# Altium schematic sheet Evaluation kit.SchDoc
size A3; SheetNumber: 1; SheetTotal: 1
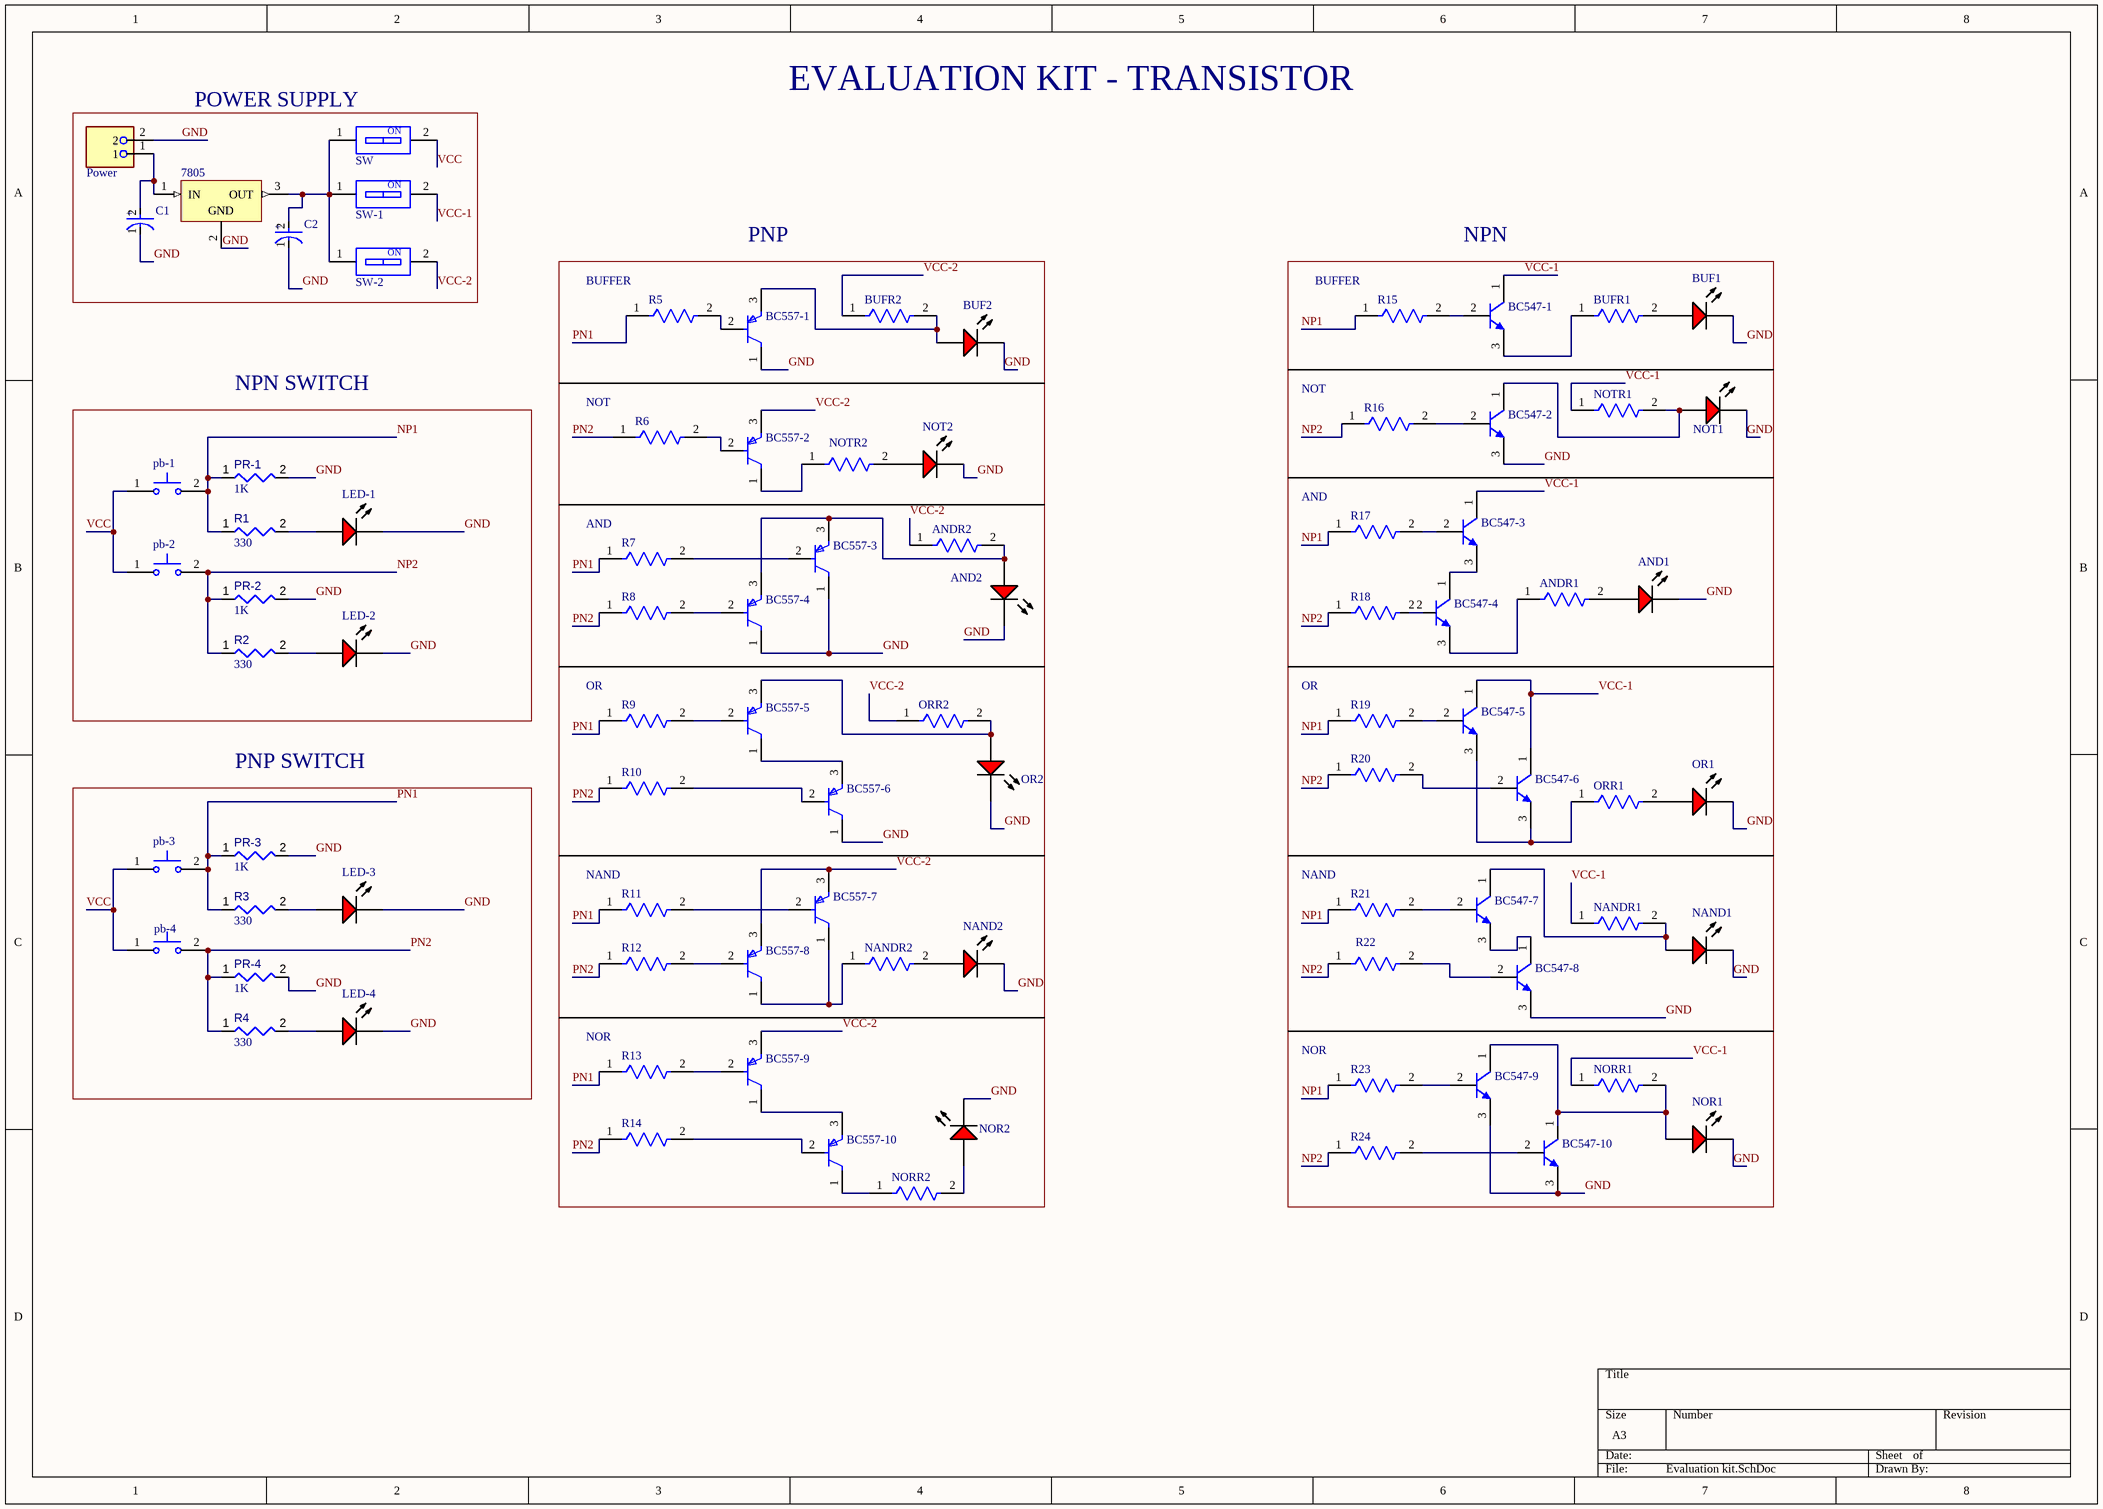
[diagram p0: Evaluation kit.SchDoc]

## Parts
7805  LM7805ACT  [FAIR-TO-220-3]  (value not drawn)
AND1  LTL-1CHE  [INDPR60-254-520X380X650]  (value not drawn)
AND2  LTL-1CHE  [INDPR60-254-520X380X650]  (value not drawn)
ANDR1  MBA02040C2200FC100  [FP-MBA0204-MFG]  (value not drawn)
ANDR2  MBA02040C2200FC100  [FP-MBA0204-MFG]  (value not drawn)
BC547-1  BC547BRL1G  [ONSC-TO-92-3-29-11_AM_BL]  (value not drawn)
BC547-2  BC547BRL1G  [ONSC-TO-92-3-29-11_AM_BL]  (value not drawn)
BC547-3  BC547BRL1G  [ONSC-TO-92-3-29-11_AM_BL]  (value not drawn)
BC547-4  BC547BRL1G  [ONSC-TO-92-3-29-11_AM_BL]  (value not drawn)
BC547-5  BC547BRL1G  [ONSC-TO-92-3-29-11_AM_BL]  (value not drawn)
BC547-6  BC547BRL1G  [ONSC-TO-92-3-29-11_AM_BL]  (value not drawn)
BC547-7  BC547BRL1G  [ONSC-TO-92-3-29-11_AM_BL]  (value not drawn)
BC547-8  BC547BRL1G  [ONSC-TO-92-3-29-11_AM_BL]  (value not drawn)
BC547-9  BC547BRL1G  [ONSC-TO-92-3-29-11_AM_BL]  (value not drawn)
BC547-10  BC547BRL1G  [ONSC-TO-92-3-29-11_AM_BL]  (value not drawn)
BC557-1  BC557BTF  [FP-135AR-MFG]  (value not drawn)
BC557-2  BC557BTF  [FP-135AR-MFG]  (value not drawn)
BC557-3  BC557BTF  [FP-135AR-MFG]  (value not drawn)
BC557-4  BC557BTF  [FP-135AR-MFG]  (value not drawn)
BC557-5  BC557BTF  [FP-135AR-MFG]  (value not drawn)
BC557-6  BC557BTF  [FP-135AR-MFG]  (value not drawn)
BC557-7  BC557BTF  [FP-135AR-MFG]  (value not drawn)
BC557-8  BC557BTF  [FP-135AR-MFG]  (value not drawn)
BC557-9  BC557BTF  [FP-135AR-MFG]  (value not drawn)
BC557-10  BC557BTF  [FP-135AR-MFG]  (value not drawn)
BUF1  LTL-1CHE  [INDPR60-254-520X380X650]  (value not drawn)
BUF2  LTL-1CHE  [INDPR60-254-520X380X650]  (value not drawn)
BUFR1  MBA02040C2200FC100  [FP-MBA0204-MFG]  (value not drawn)
BUFR2  MBA02040C2200FC100  [FP-MBA0204-MFG]  (value not drawn)
C1  EEU-FR1H101B  [FP-EEU-FR1H101B-MFG]  (value not drawn)
C2  EEU-FR1H101B  [FP-EEU-FR1H101B-MFG]  (value not drawn)
LED-1  LTL-1CHE  [INDPR60-254-520X380X650]  (value not drawn)
LED-2  LTL-1CHE  [INDPR60-254-520X380X650]  (value not drawn)
LED-3  LTL-1CHE  [INDPR60-254-520X380X650]  (value not drawn)
LED-4  LTL-1CHE  [INDPR60-254-520X380X650]  (value not drawn)
NAND1  LTL-1CHE  [INDPR60-254-520X380X650]  (value not drawn)
NAND2  LTL-1CHE  [INDPR60-254-520X380X650]  (value not drawn)
NANDR1  MBA02040C2200FC100  [FP-MBA0204-MFG]  (value not drawn)
NANDR2  MBA02040C2200FC100  [FP-MBA0204-MFG]  (value not drawn)
NOR1  LTL-1CHE  [INDPR60-254-520X380X650]  (value not drawn)
NOR2  LTL-1CHE  [INDPR60-254-520X380X650]  (value not drawn)
NORR1  MBA02040C2200FC100  [FP-MBA0204-MFG]  (value not drawn)
NORR2  MBA02040C2200FC100  [FP-MBA0204-MFG]  (value not drawn)
NOT1  LTL-1CHE  [INDPR60-254-520X380X650]  (value not drawn)
NOT2  LTL-1CHE  [INDPR60-254-520X380X650]  (value not drawn)
NOTR1  MBA02040C2200FC100  [FP-MBA0204-MFG]  (value not drawn)
NOTR2  MBA02040C2200FC100  [FP-MBA0204-MFG]  (value not drawn)
OR1  LTL-1CHE  [INDPR60-254-520X380X650]  (value not drawn)
OR2  LTL-1CHE  [INDPR60-254-520X380X650]  (value not drawn)
ORR1  MBA02040C2200FC100  [FP-MBA0204-MFG]  (value not drawn)
ORR2  MBA02040C2200FC100  [FP-MBA0204-MFG]  (value not drawn)
pb-1  BUTT-2  [SW_BUTT-2]  (value not drawn)
pb-2  BUTT-2  [SW_BUTT-2]  (value not drawn)
pb-3  BUTT-2  [SW_BUTT-2]  (value not drawn)
pb-4  BUTT-2  [SW_BUTT-2]  (value not drawn)
Power  1729128  [PHOENIX_1729128]  (value not drawn)
PR-1  value 1K  [RESA60-630X240]  (hidden comment: MFR-25FBF52-100R)
PR-2  value 1K  [RESA60-630X240]  (hidden comment: MFR-25FBF52-100R)
PR-3  value 1K  [RESA60-630X240]  (hidden comment: MFR-25FBF52-100R)
PR-4  value 1K  [RESA60-630X240]  (hidden comment: MFR-25FBF52-100R)
R1  value 330  [RESA60-630X240]  (hidden comment: MFR-25FBF52-100R)
R2  value 330  [RESA60-630X240]  (hidden comment: MFR-25FBF52-100R)
R3  value 330  [RESA60-630X240]  (hidden comment: MFR-25FBF52-100R)
R4  value 330  [RESA60-630X240]  (hidden comment: MFR-25FBF52-100R)
R5  MBA02040C2200FC100  [FP-MBA0204-MFG]  (value not drawn)
R6  MBA02040C2200FC100  [FP-MBA0204-MFG]  (value not drawn)
R7  MBA02040C2200FC100  [FP-MBA0204-MFG]  (value not drawn)
R8  MBA02040C2200FC100  [FP-MBA0204-MFG]  (value not drawn)
R9  MBA02040C2200FC100  [FP-MBA0204-MFG]  (value not drawn)
R10  MBA02040C2200FC100  [FP-MBA0204-MFG]  (value not drawn)
R11  MBA02040C2200FC100  [FP-MBA0204-MFG]  (value not drawn)
R12  MBA02040C2200FC100  [FP-MBA0204-MFG]  (value not drawn)
R13  MBA02040C2200FC100  [FP-MBA0204-MFG]  (value not drawn)
R14  MBA02040C2200FC100  [FP-MBA0204-MFG]  (value not drawn)
R15  MBA02040C2200FC100  [FP-MBA0204-MFG]  (value not drawn)
R16  MBA02040C2200FC100  [FP-MBA0204-MFG]  (value not drawn)
R17  MBA02040C2200FC100  [FP-MBA0204-MFG]  (value not drawn)
R18  MBA02040C2200FC100  [FP-MBA0204-MFG]  (value not drawn)
R19  MBA02040C2200FC100  [FP-MBA0204-MFG]  (value not drawn)
R20  MBA02040C2200FC100  [FP-MBA0204-MFG]  (value not drawn)
R21  MBA02040C2200FC100  [FP-MBA0204-MFG]  (value not drawn)
R22  MBA02040C2200FC100  [FP-MBA0204-MFG]  (value not drawn)
R23  MBA02040C2200FC100  [FP-MBA0204-MFG]  (value not drawn)
R24  MBA02040C2200FC100  [FP-MBA0204-MFG]  (value not drawn)
SW  418117170901  [418117170901]  (value not drawn)
SW-1  418117170901  [418117170901]  (value not drawn)
SW-2  418117170901  [418117170901]  (value not drawn)

## Blocks framed on the sheet
POWER SUPPLY: 7805 C1 C2 Power SW SW-1 SW-2
PNP: AND2 ANDR2 BC557-1-BC557-10 BUF2 BUFR2 NAND2 NANDR2 NOR2 NORR2 NOT2 NOTR2 OR2 ORR2 R5-R14
NPN: AND1 ANDR1 BC547-1-BC547-10 BUF1 BUFR1 NAND1 NANDR1 NOR1 NORR1 NOT1 NOTR1 OR1 ORR1 R15-R24
NPN SWITCH: LED-1 LED-2 pb-1 pb-2 PR-1 PR-2 R1 R2
PNP SWITCH: LED-3 LED-4 pb-3 pb-4 PR-3 PR-4 R3 R4

## Nets
GND: 7805.2(GND) AND1.2(K) AND2.2(K) BC547-2.3(E) BC547-8.3(E) BC547-9.3(E) BC547-10.3(E) BC557-1.1(C) BC557-3.1(C) BC557-4.1(C) BC557-6.1(C) BUF1.2(K) BUF2.2(K) C1.1(C) C2.1(C) LED-1.2(K) LED-2.2(K) LED-3.2(K) LED-4.2(K) NAND1.2(K) NAND2.2(K) NOR1.2(K) NOR2.2(K) NOT1.2(K) NOT2.2(K) OR1.2(K) OR2.2(K) Power.2 PR-1.2 PR-2.2 PR-3.2 PR-4.2
NP1: pb-1.2 PR-1.1 R1.1 R15.1 R17.1 R19.1 R21.1 R23.1
NP2: pb-2.2 PR-2.1 R2.1 R16.1 R18.1 R20.1 R22.1 R24.1
PN1: pb-3.2 PR-3.1 R3.1 R5.1 R7.1 R9.1 R11.1 R13.1
PN2: pb-4.2 PR-4.1 R4.1 R6.1 R8.1 R10.1 R12.1 R14.1
VCC: pb-1.1 pb-2.1 pb-3.1 pb-4.1 SW.2
VCC-1: BC547-1.1(C) BC547-3.1(C) BC547-5.1(C) BC547-6.1(C) NANDR1.1 NORR1.1 NOTR1.1 SW-1.2
VCC-2: ANDR2.1 BC557-2.3(E) BC557-7.3(E) BC557-8.3(E) BC557-9.3(E) BUFR2.1 ORR2.1 SW-2.2
Net7805_1: 7805.1(IN) C1.2(A) Power.1
Net7805_3: 7805.3(OUT) C2.2(A) SW.1 SW-1.1 SW-2.1
NetAND1_1: AND1.1(A) ANDR1.2
NetAND2_1: AND2.1(A) ANDR2.2 BC557-3.3(E) BC557-4.3(E)
NetANDR1_1: ANDR1.1 BC547-4.3(E)
NetBC547-1_2: BC547-1.2(B) R15.2
NetBC547-1_3: BC547-1.3(E) BUFR1.1
NetBC547-2_1: BC547-2.1(C) NOT1.1(A) NOTR1.2
NetBC547-2_2: BC547-2.2(B) R16.2
NetBC547-3_2: BC547-3.2(B) R17.2
NetBC547-3_3: BC547-3.3(E) BC547-4.1(C)
NetBC547-4_2: BC547-4.2(B) R18.2
NetBC547-5_2: BC547-5.2(B) R19.2
NetBC547-5_3: BC547-5.3(E) BC547-6.3(E) ORR1.1
NetBC547-6_2: BC547-6.2(B) R20.2
NetBC547-7_1: BC547-7.1(C) NAND1.1(A) NANDR1.2
NetBC547-7_2: BC547-7.2(B) R21.2
NetBC547-7_3: BC547-7.3(E) BC547-8.1(C)
NetBC547-8_2: BC547-8.2(B) R22.2
NetBC547-9_1: BC547-9.1(C) BC547-10.1(C) NOR1.1(A) NORR1.2
NetBC547-9_2: BC547-9.2(B) R23.2
NetBC547-10_2: BC547-10.2(B) R24.2
NetBC557-1_2: BC557-1.2(B) R5.2
NetBC557-1_3: BC557-1.3(E) BUF2.1(A) BUFR2.2
NetBC557-2_1: BC557-2.1(C) NOTR2.1
NetBC557-2_2: BC557-2.2(B) R6.2
NetBC557-3_2: BC557-3.2(B) R7.2
NetBC557-4_2: BC557-4.2(B) R8.2
NetBC557-5_1: BC557-5.1(C) BC557-6.3(E)
NetBC557-5_2: BC557-5.2(B) R9.2
NetBC557-5_3: BC557-5.3(E) OR2.1(A) ORR2.2
NetBC557-6_2: BC557-6.2(B) R10.2
NetBC557-7_1: BC557-7.1(C) BC557-8.1(C) NANDR2.1
NetBC557-7_2: BC557-7.2(B) R11.2
NetBC557-8_2: BC557-8.2(B) R12.2
NetBC557-9_1: BC557-9.1(C) BC557-10.3(E)
NetBC557-9_2: BC557-9.2(B) R13.2
NetBC557-10_1: BC557-10.1(C) NORR2.1
NetBC557-10_2: BC557-10.2(B) R14.2
NetBUF1_1: BUF1.1(A) BUFR1.2
NetLED-1_1: LED-1.1(A) R1.2
NetLED-2_1: LED-2.1(A) R2.2
NetLED-3_1: LED-3.1(A) R3.2
NetLED-4_1: LED-4.1(A) R4.2
NetNAND2_1: NAND2.1(A) NANDR2.2
NetNOR2_1: NOR2.1(A) NORR2.2
NetNOT2_1: NOT2.1(A) NOTR2.2
NetOR1_1: OR1.1(A) ORR1.2

## Notes on the sheet
- EVALUATION KIT - TRANSISTOR
- (near R5) BUFFER
- (near R15) BUFFER
- (near R6) NOT
- NOT
- (near R17) AND
- (near R7) AND
- (near R9) OR
- (near R19) OR
- (near R11) NAND
- (near R21) NAND
- (near R13) NOR
- (near R23) NOR
- (in symbol 418117170901) ON
- (in symbol CMP-05427-000020-1) +

## Library data of the parts
7805 = CMP-2000-04937-1: Positive Voltage Regulator, 5 V, 1 A, 0 to 125 degC, 3-Pin TO-220, RoHS, Tube; Manufacturer: Fairchild; Number of Outputs: 1; Typical Dropout Voltage @ Current: 2V@1A; Output Type: Fixed; Output Voltage: 5V; Quiescent Current: 6mA; Dropout Voltage Measurement Current: 1A; Line Regulation: 50mV; Maximum Input Voltage: 35V; Regulator Function: Linear; Load Regulation: 100mV; Package Type: TO-220; Mounting Type: ThroughHole; Height: 16.51mm; Maximum Operating Temperature: +125degC; Datasheet Version: Rev. 1.0.1, 05/2006; Package Reference: TO-220; Minimum Operating Temperature: 0degC; Manufacturer URL: https://www.fairchildsemi.com/; Package URL: https://www.fairchildsemi.com/package-drawings/TO/TO220B03.pdf; Length: 10.67mm; Series: LM78xx; Dimensions: 10.67x4.83x16.51mm; Polarity: Positive; Maximum Output Current: 1A; Pin Count: 3; Width: 4.83mm; Package Description: 3-Pin Through Hole Device, Body 10 x 4.5 mm, Pitch 2.54 mm; Datasheet URL: https://datasheet.ciiva.com/5816/1359194-5816420.pdf
AND1 AND2 BUF1 BUF2 LED-1-LED-4 NAND1 NAND2 NOR1 NOR2 NOT1 NOT2 OR1 OR2 = CMP-007-00018-2: LED Uni-Color Red, 100 mW, 30 mA, -55 to 100 degC, 2-Pin THD, RoHS, Bulk; Manufacturer: Lite-On; Forward Current: 20mA; Nominal Vf: 2V; Viewing Angle: 60degrees; Luminous Intensity: 12.6mcd; Lens Style: Dome; Pins: 2; RoHS Compliant: True; Package Reference: LTL-1CHE; Package Quantity: 1000; Mounting Technology: TH; Min Operating Temperature: -55°C; Colour: Red; Case/Package: Radial; Manufacturer URL: http://www.us.liteon.com/; Datasheet URL: https://datasheet.ciiva.com/15117/getdatasheetpartid-187746-15117985.pdf; Forward Voltage: 2V; Max Operating Temperature: 100°C; Illumination Colour: Red; Package Description: 2-Pin Through Hole Device, Dia 3.8 mm, Pitch 2.54 mm; Packaging: Bulk; Datasheet Version: Dec-03
ANDR1 ANDR2 BUFR1 BUFR2 NANDR1 NANDR2 NORR1 NORR2 NOTR1 NOTR2 ORR1 ORR2 R5-R24 = CMP-02408-000005-1: RES 220 OHM 0.4W 1% AXIAL; Manufacturer: Vishay BC Components; Automotive Grade: Grade 1; Value: 220Ω; Voltage Rating: 200V; Temperature Coefficient: 50ppm/°C; Power Rating: 0.25W; Digikey Description: RES 220 OHM 0.4W 1% AXIAL; Height: 1.6mm; Automotive: Yes; Lead Free: Yes; Mouser Description: Thin Film Resistors - Through Hole .4watt 220ohms 1% 1/8watt body size; Temperature Range Low: -55°C; ComponentLink2Description: Datasheet; Temperature: -55°C to +125°C; Device Class L3: Through-Hole Resistors; Manufacturer Part Number: MBA02040C2200FC100; Ipc Land Pattern Name: RESAD500W65L360D160; Octopart: https://octopart.com/mba02040c2200fc100-vishay-43743094; Series: MBA/SMA 0204; RoHS: TRUE; Tolerance: 1%; Package: MBA0204; Device Class L1: Passive Components; ComponentLink2URL: http://www.vishay.com/docs/28766/mbxsma.pdf; Category: Res; Composition: Metal Film; Device Class L2: Resistors; Temperature Range High: +125°C; Resistance: 220Ω
BC547-1-BC547-10 = CMP-1048-01605-1: Amplifier Transistor, NPN Silicon, 3-Pin TO-92, Pb-Free, Tape and Reel; Manufacturer: On Semiconductor; IC Continuous (A): 0.1; fT Min (MHz): 150; ComponentLink2URL: http://www.onsemi.com/pub_link/Collateral/BC546-D.PDF; ComponentLink1URL: http://www.onsemi.com/; ComponentLink2Description: Datasheet; RoHS: TRUE; ComponentLink3Description: Package Specification; ComponentLink1Description: Manufacturer URL; ComponentLink3URL: http://www.onsemi.com/pub_link/Collateral/MAC97-D.PDF; PackageDescription: 3-Pin Transistor Outline, Body 4.825 x 3.685 mm, Pitch 1.27 mm; Packing: Tape and Reel; PackageVersion: Rev. AM; Polarity: NPN; DatasheetVersion: Rev. 7; Mounting Technology: Through Hole; PackageReference: TO-92-3-29-11_AM_BL; PartNumber: BC547BRL1G
BC557-1-BC557-10 = CMP-00278-84408945-1: BC557BTF Small Signal Bipolar Transistor, 0.1A I(C), 45V V(BR)CEO, 1-Element, PNP, Silicon, TO-92; Manufacturer Lifecycle Status: ACTIVE; Max Power Dissipation: 500mW; Frequency: 150MHz; hFE Min: 110; Number of Elements: 1; Current Rating: -100mA; Collector Emitter Saturation Voltage: -250mV; Max Collector Current: 100mA; Emitter Base Voltage (VEBO): -5V; Voltage Rating (DC): -45V; Element Configuration: Single; Max Frequency: 10MHz; Collector Base Voltage (VCBO): -50V; Collector Emitter Voltage (VCEO): 45V; Contact Plating: Tin; Min Operating Temperature: -65°C; RoHS: Compliant; Max Operating Temperature: 150°C; Weight: 240mg; Power Dissipation: 500mW; Lifecycle Status: Production; Case/Package: TO-92; Collector Emitter Breakdown Voltage: 45V; Length: 5.2mm; Schedule B: 8541210080, 8541210080; Lead Free: Lead Free; Polarity: PNP; REACH SVHC: No SVHC; Mount: Through Hole; NexarPartId: 84408945; Max Breakdown Voltage: 45V; Transition Frequency: 150MHz; Height: 5.33mm; Number of Pins: 3; Gain Bandwidth Product: 150MHz; Width: 4.19mm
C1 C2 = CMP-05427-000020-1: CAP ALUM 100UF 20% 50V RADIAL; Life (Hours): 6000Hour; Ripple Current: 870mA; Lead Diameter: 0.6mm; Impedance: 61mR; Tolerance: 20%; Mount: Through Hole; Lead Free: Lead Free; Length: 11.5mm; Height - Seated (Max): 0.512inch; Contact Plating: Tin; Termination: Radial; Series: FR; Max Operating Temperature: 105°C; Features: General Purpose; Min Operating Temperature: -40°C; RoHS Compliant: Yes; Height: 11.5mm; Voltage Rating (DC): 50V; Diameter: 8mm; Capacitance: 100uF; Lead Pitch: 5mm; Radiation Hardening: No; Package Quantity: 1; Case/Package: Radial; Voltage Rating: 50V; Packaging: Tape and Reel; ESR (Equivalent Series Resistance): 61mR; REACH SVHC: No SVHC
pb-1-pb-4 = BUTT-2: Tactile Switches MINI PUSH BUTTON SWITCH 2-PIN QTY. 4; MF: Gravitech; Purchase-URL: https://pricing.snapeda.com/search/part/BUTT-2/?ref=eda; Package: None; Value: *; Check_prices: https://www.snapeda.com/parts/BUTT-2/Gravitech/view-part/?ref=eda; SnapEDA_Link: https://www.snapeda.com/parts/BUTT-2/Gravitech/view-part/?ref=snap; Availability: In Stock; Price: None; MP: BUTT-2
Power = 1729128: PCB Terminal Screw 5.08mm 16AWG 400V 13.5A 2 Position COMBICON MKDSN Series | Phoenix Contact 1729128; SnapEDA_Link: https://www.snapeda.com/parts/1729128/Phoenix+Contact/view-part/?ref=snap; Package: None; Value: *; MF: Phoenix Contact; MP: 1729128; Check_prices: https://www.snapeda.com/parts/1729128/Phoenix+Contact/view-part/?ref=eda
PR-1-PR-4 R1-R4 = CMP-009-00046-4: Axial Resistor, 100 Ohm, +/- 1%, 0.25 W, -55 to 155 degC, 2-Pin THD, RoHS, Bulk; Manufacturer: Yageo; Voltage Rating: 250V; Power: 250mW; Packaging: Bulk; Max Operating Temperature: 155°C; Mounting Technology: TH; Datasheet Version: Apr-13; Case/Package: Axial; RoHS Compliant: True; Package Description: 2-Pin Axial Lead, Dia 2.4 mm, Body Length 6.3 mm; Package Quantity: 200; Package Reference: MFR-25; Tolerance: 1%; Composition: CarbonFilm; Datasheet URL: http://www.yageo.com/documents/recent/Yageo%20LR_MFR_2013.pdf; Manufacturer URL: http://www.yageo.com/; Min Operating Temperature: -55°C
SW SW-1 SW-2 = 418117170901: WS-DITV Compact THT Dip Switch, Flat Actuator, pitch 2.54mm, 1p; Manufacturer: Wurth Elektronik; Actuator Type: Flat Type; Operation Force: 800g; Rated Current Non-Switching: 100mA; Rated Current Switching: 25mA; Rated Voltage Non-Switching: 50VDC; Rated Voltage Switching: 24VDC; Number of Poles: 1; ComponentLink1Description: Website Link; ComponentLink1URL: https://www.we-online.com/redexpert/article/418117170901?ad; ComponentLink2Description: Datasheet Link; ComponentLink2URL: https://www.we-online.com/redexpert/spec/418117170901?ad; Manufacturer Part Number: 418117170901; Category: Dip Switches; Match Code: WS-DITV; Mount: Through Hole; Operating Temperature Max: 85°C; Operating Temperature Min: -40°C; Packaging: Tube; Contact Material: Copper Alloy; Contact Plating: Gold; Pitch: 2.54mm